# EAGLE board omni-usb_1.00a (EAGLE 6.6.0), part 1 of 3
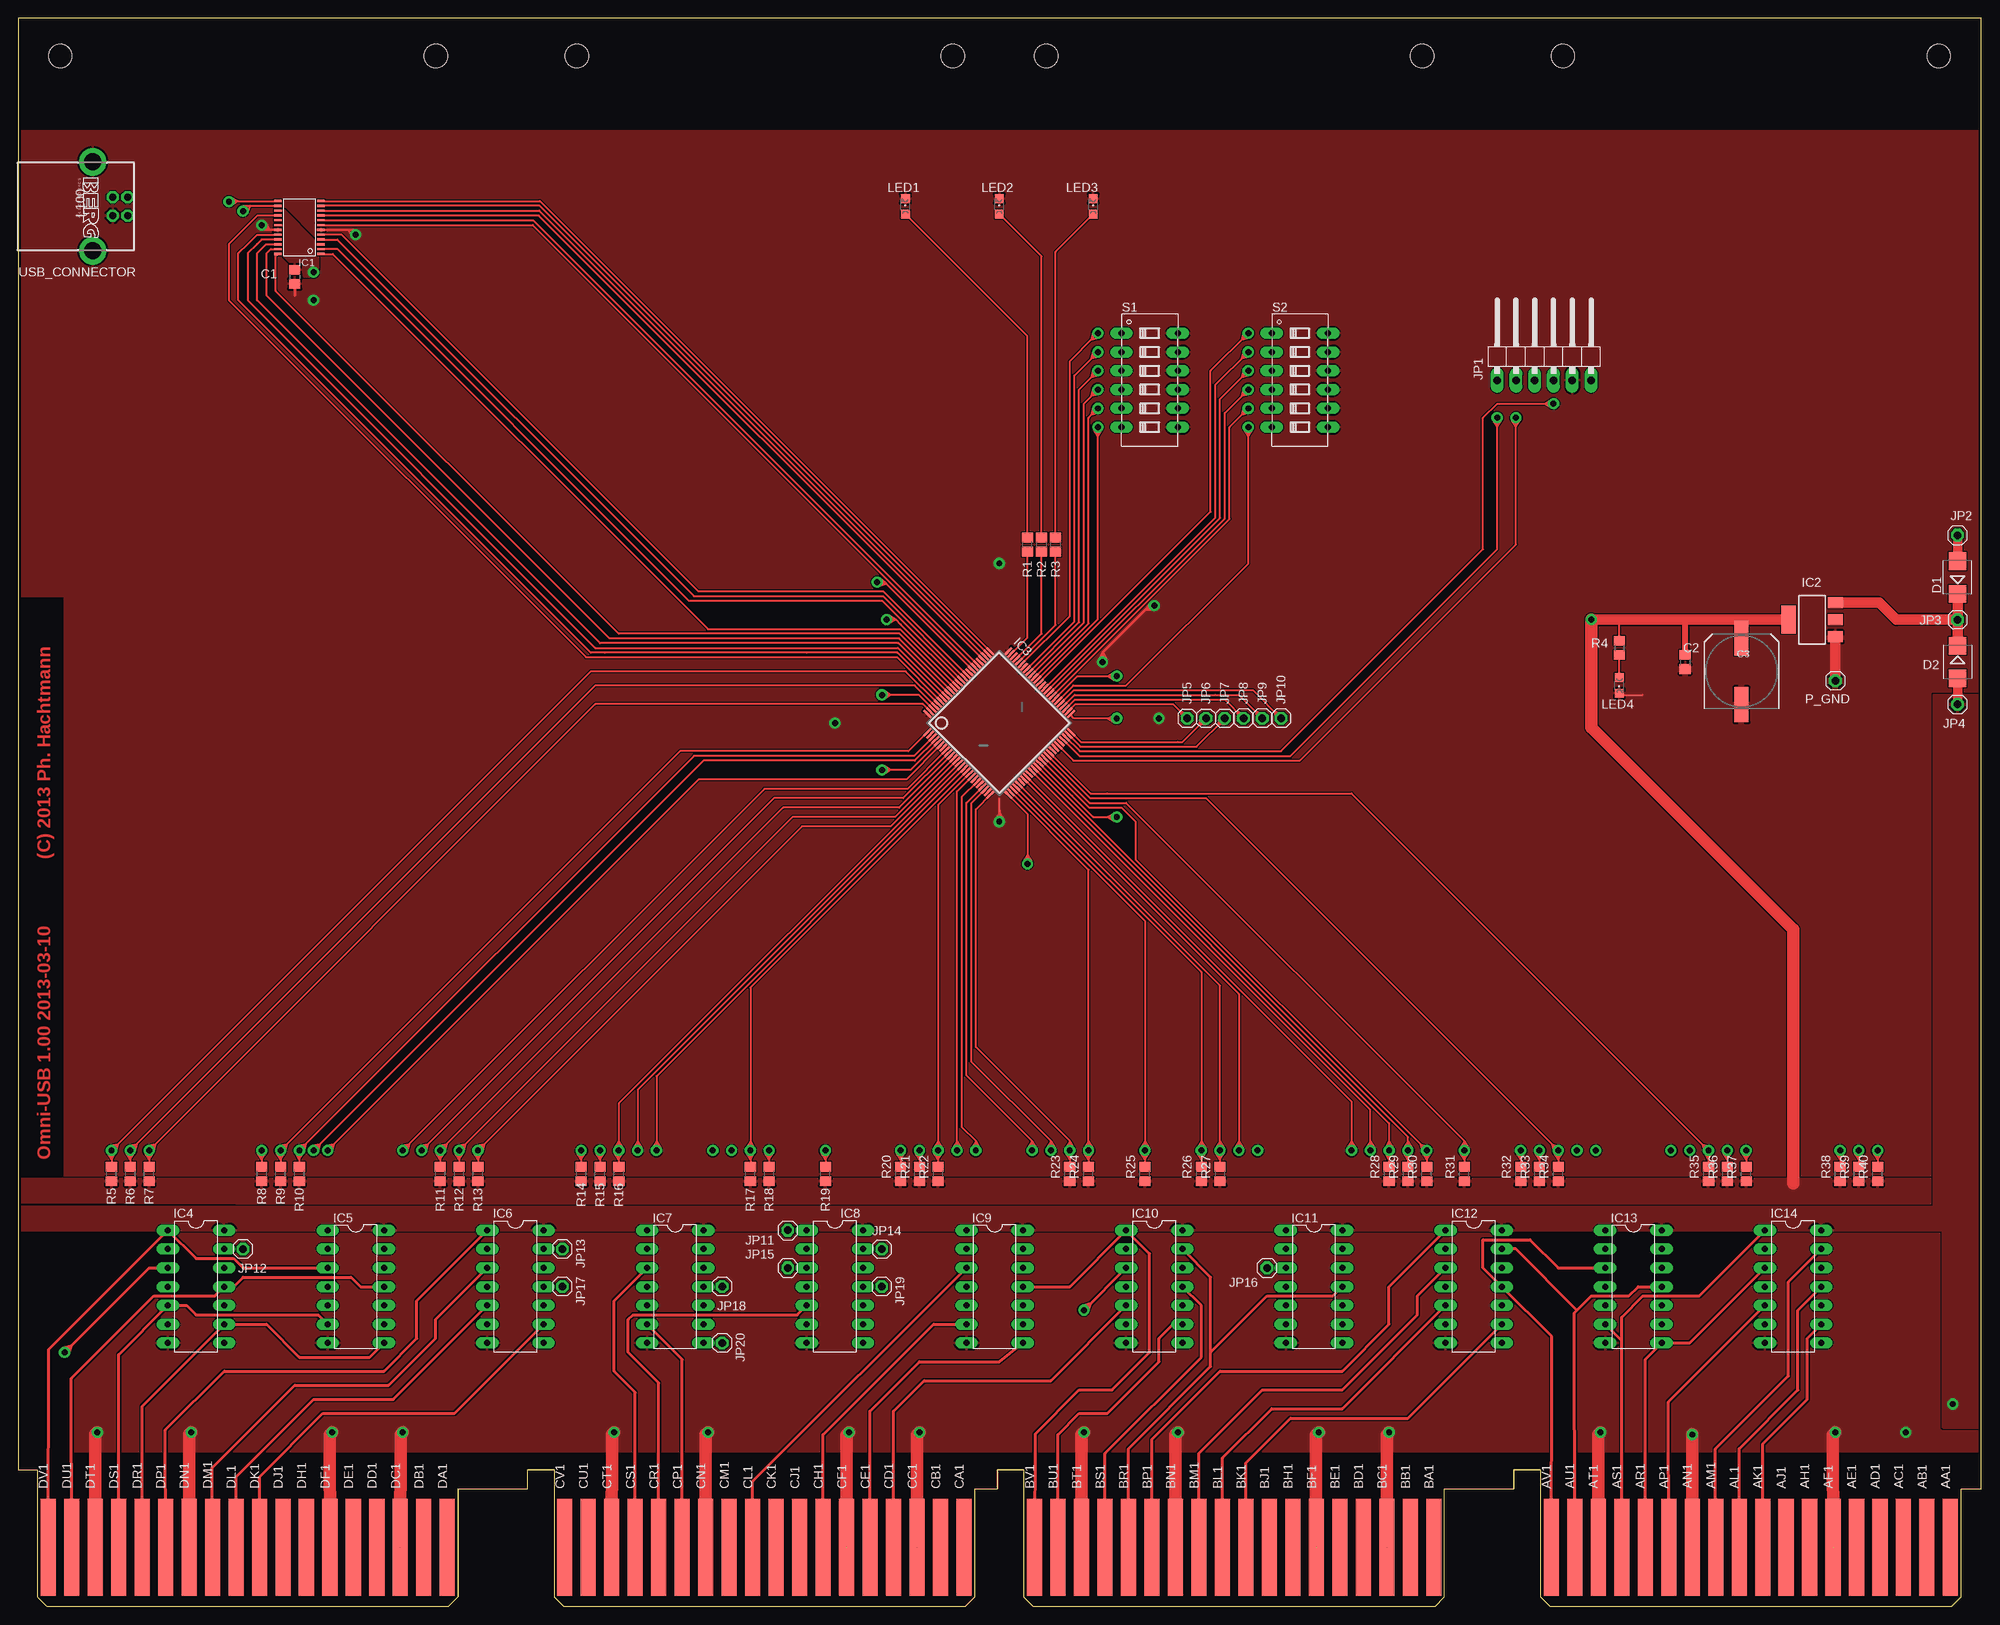
[diagram p3: board, top side]
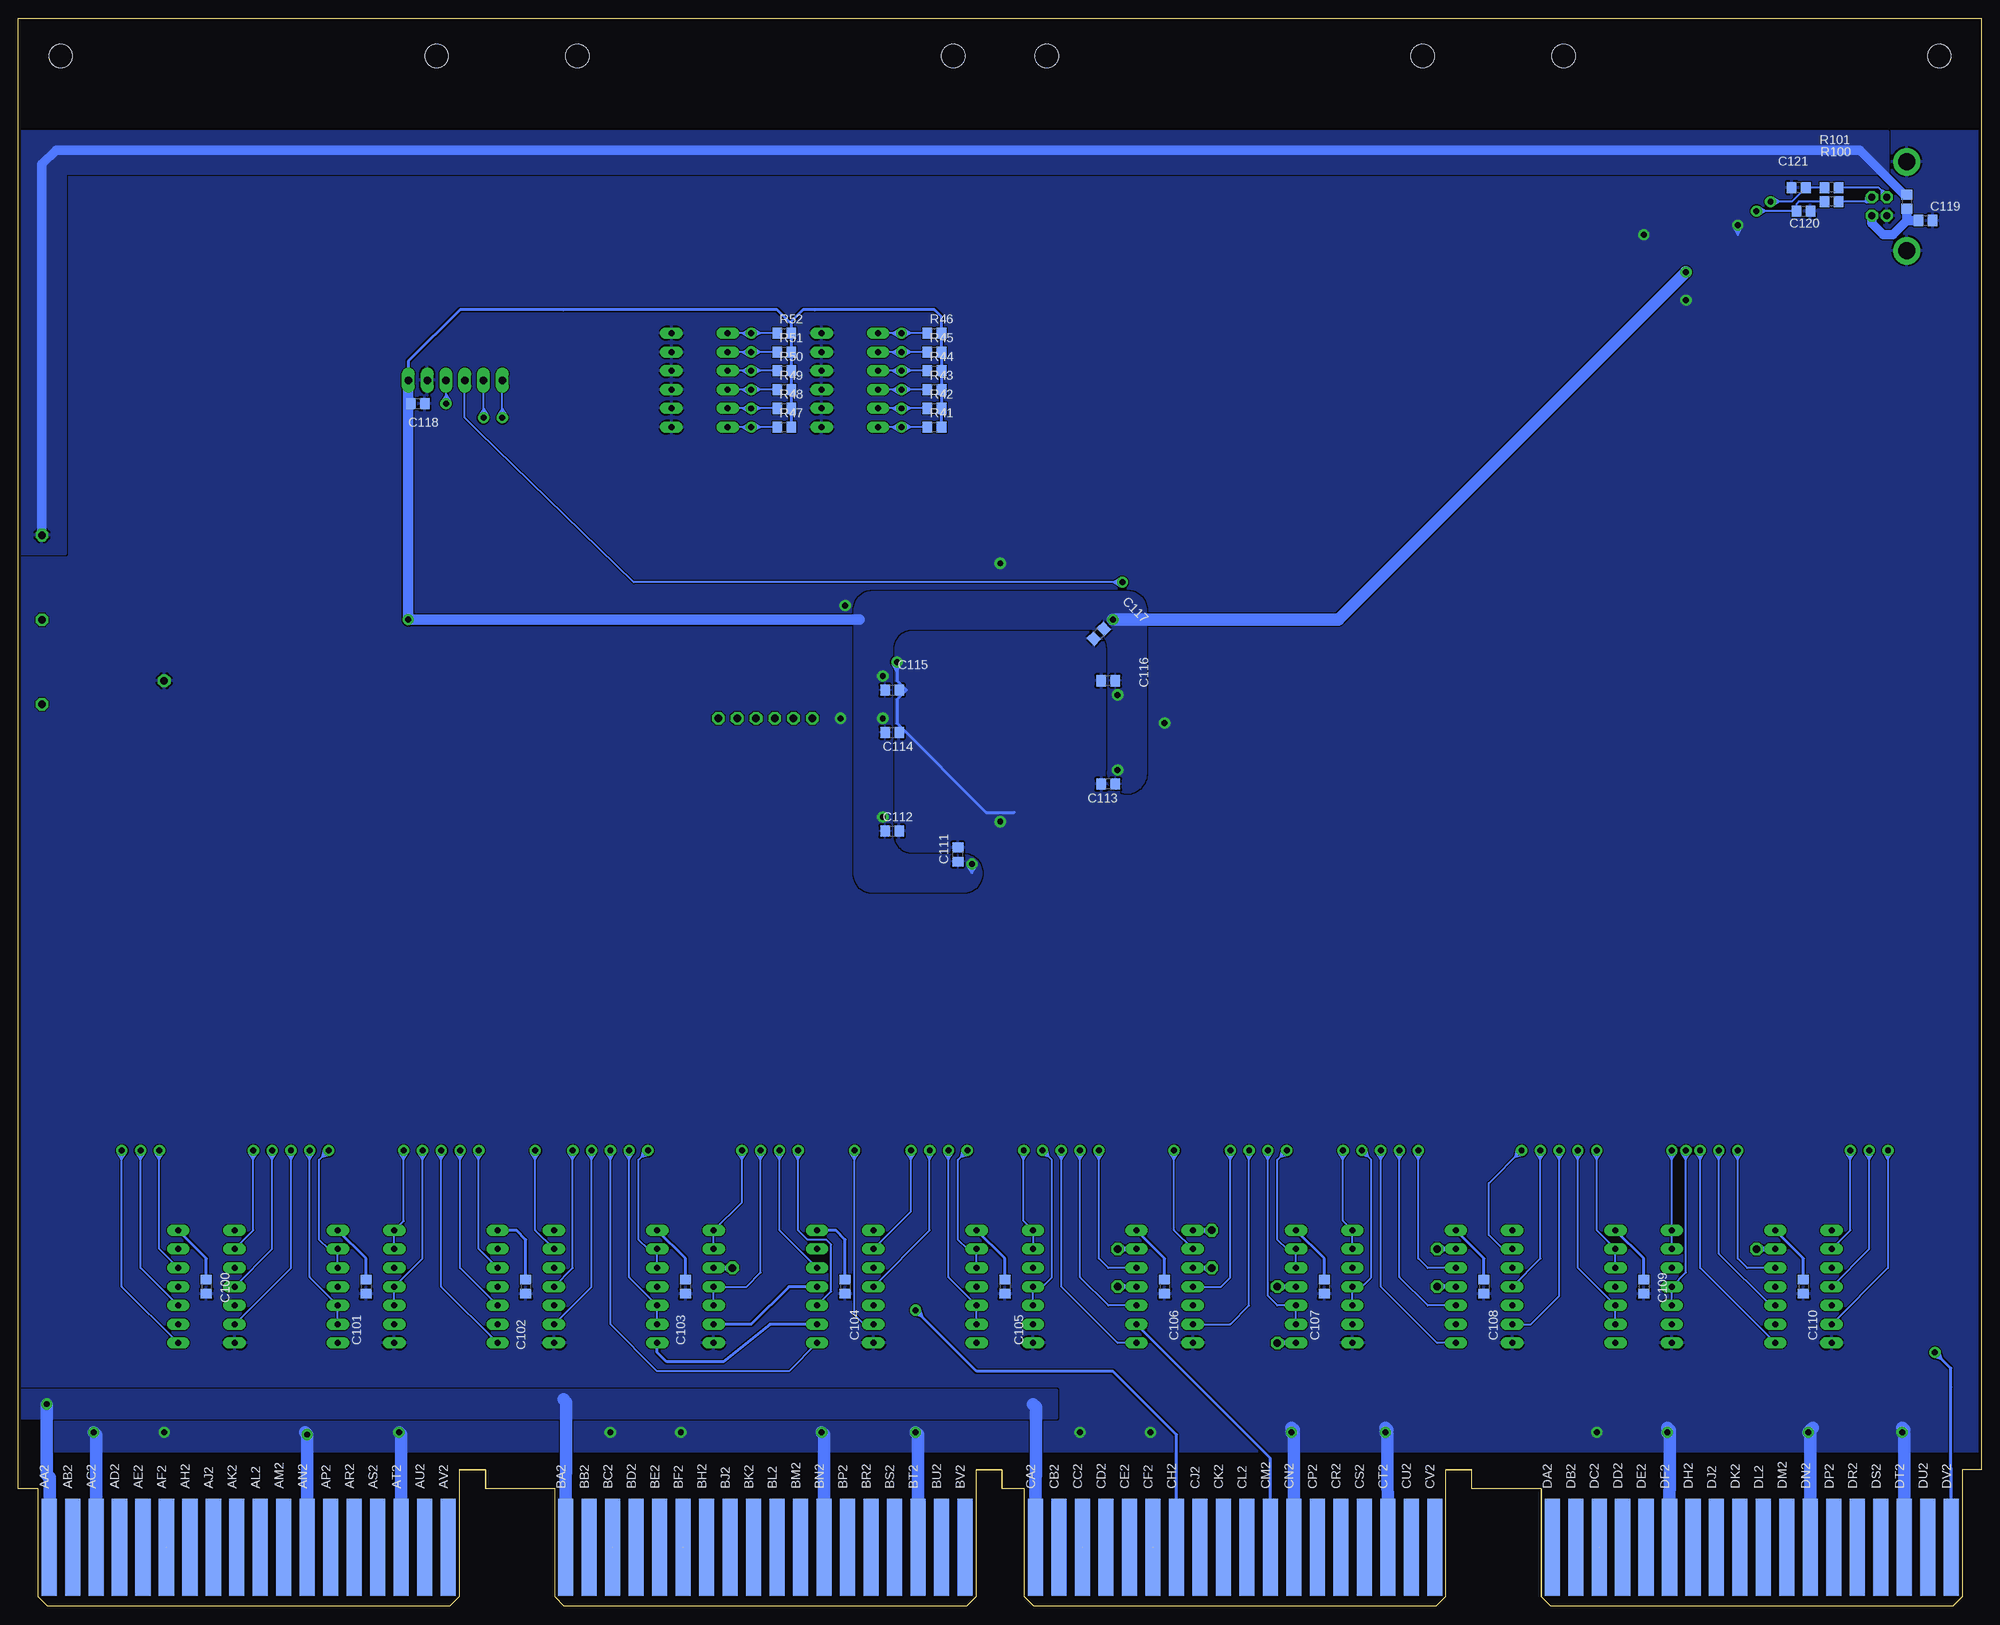
[diagram p4: board, bottom side, seen from below]

Size 265.3 x 214.63 mm. Coordinates in mm from the lower left corner, seen from the top.
Copper layers (1*16): Top 0.035mm / dielectric 1.5mm / Bottom 0.035mm
Design rules "default *": minimum track width 6mil, minimum drill 0.8mm, track to track 6mil, track to pad 6mil, pad to pad 6mil, via to via 6mil, smd to smd 6mil, copper to edge 15mil, drill to drill 8mil, minimum pad ring 14mil, minimum via ring 14mil, stop-mask expansion 4mil, vias tented up to drill 0mil, thermal gap 10mil

## Footprints (pad centres in the part's own frame; a part is rotated, then mirrored left to right if it is on the bottom)
C0805 = smd 1.3 x 1.5: 1 -0.95,0; 2 0.95,0
SANYO-OSCON_SMD_F8 = smd 4.7 x 1.9: + 4.5,0; - -4.5,0
SMB = smd 2.4 x 2.4: A 2.2,0; C -2.2,0
TSSOP24 = smd 0.305 x 0.991: 1 -3.575,-2.918; 2 -2.925,-2.918; 3 -2.275,-2.918; 4 -1.625,-2.918; 5 -0.975,-2.918; 6 -0.325,-2.918; 7 0.325,-2.918; 8 0.975,-2.918; 9 1.625,-2.918; 10 2.275,-2.918; 11 2.925,-2.918; 12 3.575,-2.918; 13 3.575,2.918; 14 2.925,2.918; 15 2.275,2.918; 16 1.625,2.918; 17 0.975,2.918; 18 0.325,2.918; 19 -0.325,2.918; 20 -0.975,2.918; 21 -1.625,2.918; 22 -2.275,2.918; 23 -2.925,2.918; 24 -3.575,2.918
SOT223 = smd 1.5 x 2: 1 -2.3,-3.15; 2 0,-3.15; 3 2.3,-3.15 | smd 3.8 x 2: 4 0,3.15
TQ100 = smd 0.3 x 1.6: 1 -6,-7.6; 2 -5.5,-7.6; 3 -5,-7.6; 4 -4.5,-7.6; 5 -4,-7.6; 6 -3.5,-7.6; 7 -3,-7.6; 8 -2.5,-7.6; 9 -2,-7.6; 10 -1.5,-7.6; 11 -1,-7.6; 12 -0.5,-7.6; 13 0,-7.6; 14 0.5,-7.6; 15 1,-7.6; 16 1.5,-7.6; 17 2,-7.6; 18 2.5,-7.6; 19 3,-7.6; 20 3.5,-7.6; 21 4,-7.6; 22 4.5,-7.6; 23 5,-7.6; 24 5.5,-7.6; 25 6,-7.6; 51 6,7.6; 52 5.5,7.6; 53 5,7.6; 54 4.5,7.6; 55 4,7.6; 56 3.5,7.6; 57 3,7.6; 58 2.5,7.6; 59 2,7.6; 60 1.5,7.6; 61 1,7.6; 62 0.5,7.6; 63 0,7.6; 64 -0.5,7.6; 65 -1,7.6; 66 -1.5,7.6; 67 -2,7.6; 68 -2.5,7.6; 69 -3,7.6; 70 -3.5,7.6; 71 -4,7.6; 72 -4.5,7.6; 73 -5,7.6; 74 -5.5,7.6; 75 -6,7.6 | smd 1.6 x 0.3: 26 7.6,-6; 27 7.6,-5.5; 28 7.6,-5; 29 7.6,-4.5; 30 7.6,-4; 31 7.6,-3.5; 32 7.6,-3; 33 7.6,-2.5; 34 7.6,-2; 35 7.6,-1.5; 36 7.6,-1; 37 7.6,-0.5; 38 7.6,0; 39 7.6,0.5; 40 7.6,1; 41 7.6,1.5; 42 7.6,2; 43 7.6,2.5; 44 7.6,3; 45 7.6,3.5; 46 7.6,4; 47 7.6,4.5; 48 7.6,5; 49 7.6,5.5; 50 7.6,6; 76 -7.6,6; 77 -7.6,5.5; 78 -7.6,5; 79 -7.6,4.5; 80 -7.6,4; 81 -7.6,3.5; 82 -7.6,3; 83 -7.6,2.5; 84 -7.6,2; 85 -7.6,1.5; 86 -7.6,1; 87 -7.6,0.5; 88 -7.6,0; 89 -7.6,-0.5; 90 -7.6,-1; 91 -7.6,-1.5; 92 -7.6,-2; 93 -7.6,-2.5; 94 -7.6,-3; 95 -7.6,-3.5; 96 -7.6,-4; 97 -7.6,-4.5; 98 -7.6,-5; 99 -7.6,-5.5; 100 -7.6,-6
DIL14 = drill 0.813 long: 1 -7.62,-3.81; 2 -5.08,-3.81; 3 -2.54,-3.81; 4 0,-3.81; 5 2.54,-3.81; 6 5.08,-3.81; 7 7.62,-3.81; 8 7.62,3.81; 9 5.08,3.81; 10 2.54,3.81; 11 0,3.81; 12 -2.54,3.81; 13 -5.08,3.81; 14 -7.62,3.81
1X06/90 = drill 1.016 long: 1 -6.35,-3.81; 2 -3.81,-3.81; 3 -1.27,-3.81; 4 1.27,-3.81; 5 3.81,-3.81; 6 6.35,-3.81
1X01 = drill 1.016 octagon: 1 0,0
R0805 = smd 1.3 x 1.5: 1 -0.95,0; 2 0.95,0
CHIPLED_0805 = smd 1.2 x 1.2: A 0,-1.05; C 0,1.05
DIP06YL = drill 0.813 long: 1 -6.35,-3.81; 2 -3.81,-3.81; 3 -1.27,-3.81; 4 1.27,-3.81; 5 3.81,-3.81; 6 6.35,-3.81; 7 6.35,3.81; 8 3.81,3.81; 9 1.27,3.81; 10 -1.27,3.81; 11 -3.81,3.81; 12 -6.35,3.81
OMNIBUS = hole 3.175: 208.915,209.55; 259.715,209.55; 189.865,209.55; 139.065,209.55; 75.616,209.55; 126.416,209.55; 56.566,209.55; 5.766,209.55
EDGE-CON8 = smd 2.032 x 13.106: AA1 261.303,7.938; AB1 258.127,7.938; AC1 254.952,7.938; AD1 251.778,7.938; AE1 248.602,7.938; AF1 245.428,7.938; AH1 242.252,7.938; AJ1 239.077,7.938; AK1 235.903,7.938; AL1 232.727,7.938; AM1 229.553,7.938; AN1 226.377,7.938; AP1 223.202,7.938; AR1 220.028,7.938; AS1 216.852,7.938; AT1 213.678,7.938; AU1 210.502,7.938; AV1 207.327,7.938; BA1 191.452,7.938; BB1 188.278,7.938; BC1 185.102,7.938; BD1 181.928,7.938; BE1 178.752,7.938; BF1 175.577,7.938; BH1 172.403,7.938; BJ1 169.227,7.938; BK1 166.053,7.938; BL1 162.877,7.938; BM1 159.702,7.938; BN1 156.528,7.938; BP1 153.352,7.938; BR1 150.178,7.938; BS1 147.002,7.938; BT1 143.827,7.938; BU1 140.653,7.938; BV1 137.477,7.938; CA1 127.953,7.938; CB1 124.778,7.938; CC1 121.603,7.938; CD1 118.427,7.938; CE1 115.252,7.938; CF1 112.078,7.938; CH1 108.903,7.938; CJ1 105.728,7.938; CK1 102.552,7.938; CL1 99.377,7.938; CM1 96.203,7.938; CN1 93.028,7.938; CP1 89.853,7.938; CR1 86.677,7.938; CS1 83.502,7.938; CT1 80.328,7.938; CU1 77.153,7.938; CV1 73.978,7.938; DA1 58.102,7.938; DB1 54.928,7.938; DC1 51.752,7.938; DD1 48.578,7.938; DE1 45.403,7.938; DF1 42.227,7.938; DH1 39.053,7.938; DJ1 35.877,7.938; DK1 32.703,7.938; DL1 29.527,7.938; DM1 26.352,7.938; DN1 23.177,7.938; DP1 20.003,7.938; DR1 16.828,7.938; DS1 13.652,7.938; DT1 10.477,7.938; DU1 7.303,7.938; DV1 4.128,7.938 | smd 2.032 x 13.106 bottom: AA2 261.303,7.938; AB2 258.127,7.938; AC2 254.952,7.938; AD2 251.778,7.938; AE2 248.602,7.938; AF2 245.428,7.938; AH2 242.252,7.938; AJ2 239.077,7.938; AK2 235.903,7.938; AL2 232.727,7.938; AM2 229.553,7.938; AN2 226.377,7.938; AP2 223.202,7.938; AR2 220.028,7.938; AS2 216.852,7.938; AT2 213.678,7.938; AU2 210.502,7.938; AV2 207.327,7.938; BA2 191.452,7.938; BB2 188.278,7.938; BC2 185.102,7.938; BD2 181.928,7.938; BE2 178.752,7.938; BF2 175.577,7.938; BH2 172.403,7.938; BJ2 169.227,7.938; BK2 166.053,7.938; BL2 162.877,7.938; BM2 159.702,7.938; BN2 156.528,7.938; BP2 153.352,7.938; BR2 150.178,7.938; BS2 147.002,7.938; BT2 143.827,7.938; BU2 140.653,7.938; BV2 137.477,7.938; CA2 127.953,7.938; CB2 124.778,7.938; CC2 121.603,7.938; CD2 118.427,7.938; CE2 115.252,7.938; CF2 112.078,7.938; CH2 108.903,7.938; CJ2 105.728,7.938; CK2 102.552,7.938; CL2 99.377,7.938; CM2 96.203,7.938; CN2 93.028,7.938; CP2 89.853,7.938; CR2 86.677,7.938; CS2 83.502,7.938; CT2 80.328,7.938; CU2 77.153,7.938; CV2 73.978,7.938; DA2 58.102,7.938; DB2 54.928,7.938; DC2 51.752,7.938; DD2 48.578,7.938; DE2 45.403,7.938; DF2 42.227,7.938; DH2 39.053,7.938; DJ2 35.877,7.938; DK2 32.703,7.938; DL2 29.527,7.938; DM2 26.352,7.938; DN2 23.177,7.938; DP2 20.003,7.938; DR2 16.828,7.938; DS2 13.652,7.938; DT2 10.477,7.938; DU2 7.303,7.938; DV2 4.128,7.938
PN61729-S = drill 0.95 octagon: 1 1.25,4.71; 2 -1.25,4.71; 3 -1.25,2.71; 4 1.25,2.71 | drill 2.3 pad 2.9: S1 -6.02,0; S2 6.02,0

## Placement (x,y rotation side)
C1  100nF  [C0805]  37.34,179.71 270 top
C2  100nF  [C0805]  225.3,127.64 270 top
C3  220µF  [SANYO-OSCON_SMD_F8]  232.92,126.36 90 top
C100  100nF  [C0805]  239.9,43.18 270 bottom
C101  100nF  [C0805]  218.31,43.18 270 bottom
C102  100nF  [C0805]  196.72,43.18 270 bottom
C103  100nF  [C0805]  175.13,43.18 270 bottom
C104  100nF  [C0805]  153.54,43.18 270 bottom
C105  100nF  [C0805]  131.95,43.18 270 bottom
C106  100nF  [C0805]  110.36,43.18 270 bottom
C107  100nF  [C0805]  88.77,43.18 270 bottom
C108  100nF  [C0805]  67.18,43.18 270 bottom
C109  100nF  [C0805]  45.59,43.18 270 bottom
C110  100nF  [C0805]  24,43.18 270 bottom
C111  100nF  [C0805]  138.3,101.6 90 bottom
C112  100nF  [C0805]  147.19,104.78 0 bottom
C113  100nF  [C0805]  117.98,111.12 180 bottom
C114  100nF  [C0805]  147.19,118.11 0 bottom
C115  100nF  [C0805]  147.19,123.83 0 bottom
C116  100nF  [C0805]  117.98,125.09 180 bottom
C117  100nF  [C0805]  119.25,131.44 225 bottom
C118  100nF  [C0805]  211.33,162.56 0 bottom
C119  10nF  [C0805]  7.49,187.32 0 bottom
C120  47pF  [C0805]  24,188.59 0 bottom
C121  47pF  [C0805]  24.64,191.77 180 bottom
D1  [SMB]  262.13,139.06 90 top
D2  [SMB]  262.13,127.64 270 top
IC1  FT240XS  [TSSOP24]  37.97,186.37 90 top
IC2  LD117AS33TR  [SOT223]  242.44,133.35 90 top
IC3  XC9572XL_TQFP100  [TQ100]  132.59,119.38 315 top
IC4  7405N  [DIL14]  24,43.18 270 top
IC5  7438N  [DIL14]  45.59,43.18 270 top
IC6  7405N  [DIL14]  67.18,43.18 270 top
IC7  7438N  [DIL14]  88.77,43.18 270 top
IC8  7405N  [DIL14]  110.36,43.18 270 top
IC9  7438N  [DIL14]  131.95,43.18 270 top
IC10  7405N  [DIL14]  153.54,43.18 270 top
IC11  7438N  [DIL14]  175.13,43.18 270 top
IC12  7405N  [DIL14]  196.72,43.18 270 top
IC13  7438N  [DIL14]  218.31,43.18 270 top
IC14  7405N  [DIL14]  239.9,43.18 270 top
JP1  [1X06/90]  206.25,169.54 0 top
JP2  [1X01]  262.13,144.78 90 top
JP3  [1X01]  262.13,133.35 0 top
JP4  [1X01]  262.13,121.92 90 top
JP5  [1X01]  157.99,120.02 0 top
JP6  [1X01]  160.53,120.02 0 top
JP7  [1X01]  163.07,120.02 0 top
JP8  [1X01]  165.61,120.02 270 top
JP9  [1X01]  168.15,120.02 270 top
JP10  [1X01]  170.69,120.02 270 top
JP11  [1X01]  104.01,50.8 90 top
JP12  [1X01]  30.35,48.26 270 top
JP13  [1X01]  73.53,48.26 270 top
JP14  [1X01]  116.71,48.26 0 top
JP15  [1X01]  104.01,45.72 90 top
JP16  [1X01]  168.78,45.72 90 top
JP17  [1X01]  73.53,43.18 270 top
JP18  [1X01]  95.12,43.18 270 top
JP19  [1X01]  116.71,43.18 270 top
JP20  [1X01]  95.12,35.56 270 top
L100  [R0805]  10.03,189.87 270 bottom
LED1  red  [CHIPLED_0805]  119.89,189.23 0 top
LED2  green  [CHIPLED_0805]  132.59,189.23 0 top
LED3  red  [CHIPLED_0805]  145.29,189.23 0 top
LED4  green  [CHIPLED_0805]  216.41,124.46 180 top
P_GND  [1X01]  245.62,125.09 0 top
R1  330  [R0805]  136.4,143.51 90 top
R2  330  [R0805]  138.3,143.51 90 top
R3  330  [R0805]  140.21,143.51 90 top
R4  330  [R0805]  216.41,129.54 270 top
R5  1k  [R0805]  12.57,58.42 90 top
R6  1k  [R0805]  15.11,58.42 90 top
R7  1k  [R0805]  17.65,58.42 90 top
R8  1k  [R0805]  32.89,58.42 90 top
R9  1k  [R0805]  35.43,58.42 90 top
R10  1k  [R0805]  37.97,58.42 90 top
R11  1k  [R0805]  57.02,58.42 90 top
R12  1k  [R0805]  59.56,58.42 90 top
R13  1k  [R0805]  62.1,58.42 90 top
R14  1k  [R0805]  76.07,58.42 90 top
R15  1k  [R0805]  78.61,58.42 90 top
R16  1k  [R0805]  81.15,58.42 90 top
R17  1k  [R0805]  98.93,58.42 90 top
R18  1k  [R0805]  101.47,58.42 90 top
R19  1k  [R0805]  109.09,58.42 90 top
R20  1k  [R0805]  119.25,58.42 90 top
R21  1k  [R0805]  121.79,58.42 90 top
R22  1k  [R0805]  124.33,58.42 90 top
R23  1k  [R0805]  142.11,58.42 90 top
R24  1k  [R0805]  144.65,58.42 90 top
R25  1k  [R0805]  152.27,58.42 90 top
R26  1k  [R0805]  159.89,58.42 90 top
R27  1k  [R0805]  162.43,58.42 90 top
R28  1k  [R0805]  185.29,58.42 90 top
R29  1k  [R0805]  187.83,58.42 90 top
R30  1k  [R0805]  190.37,58.42 90 top
R31  1k  [R0805]  195.45,58.42 90 top
R32  1k  [R0805]  203.07,58.42 90 top
R33  1k  [R0805]  205.61,58.42 90 top
R34  1k  [R0805]  208.15,58.42 90 top
R35  1k  [R0805]  228.47,58.42 90 top
R36  1k  [R0805]  231.01,58.42 90 top
R37  1k  [R0805]  233.55,58.42 90 top
R38  1k  [R0805]  246.25,58.42 90 top
R39  1k  [R0805]  248.79,58.42 90 top
R40  1k  [R0805]  251.33,58.42 90 top
R41  47k  [R0805]  141.48,159.38 0 bottom
R42  47k  [R0805]  141.48,161.93 0 bottom
R43  47k  [R0805]  141.48,164.47 0 bottom
R44  47k  [R0805]  141.48,167 0 bottom
R45  47k  [R0805]  141.48,169.54 0 bottom
R46  47k  [R0805]  141.48,172.09 0 bottom
R47  47k  [R0805]  161.8,159.38 0 bottom
R48  47k  [R0805]  161.8,161.93 0 bottom
R49  47k  [R0805]  161.8,164.47 0 bottom
R50  47k  [R0805]  161.8,167 0 bottom
R51  47k  [R0805]  161.8,169.54 0 bottom
R52  47k  [R0805]  161.8,172.09 0 bottom
R100  27  [R0805]  20.19,189.87 180 bottom
R101  27  [R0805]  20.19,191.77 180 bottom
S1  [DIP06YL]  152.91,165.74 270 top
S2  [DIP06YL]  173.23,165.74 270 top
U$1  OUTLINE-OMNIBUS  [OMNIBUS]  -0.13,0 0 top
U$2  [EDGE-CON8]  -0.13,0 0 top
USB_CONNECTOR  PN61729-S  [PN61729-S]  10.03,189.23 270 top

## Tracks (layer width: path | path; a pad name or v marks a point on that pad's centre or on a via)
!RD
  Top 0.254: IC3.77 70.45,189.3 IC1.11
!RESET
  Top 0.254: IC1.16 32.29,188 30.99,186.69 28.45,184.15 28.45,180.34 28.45,176.53 76.71,128.27 118.75,128.27 IC3.95
!RXF
  Top 0.254: IC1.21 32.86,184.75 32.26,184.15 30.99,182.88 30.99,177.8 30.99,176.53 77.98,129.54 118.89,129.54 IC3.93
!TXE
  Top 0.254: IC3.94 118.82,128.91 106.55,128.91 79.25,128.91 77.34,128.91 29.72,176.53 29.72,182.88 30.99,184.15 32.23,185.4 IC1.20
+3V3  (via drill 0.8)
  Top 0.254: R4.1 216.41,133.35 | IC3.38 142.43,109.54 | 142.43,109.54 | 142.43,109.54 145.29,106.68 v148.46,106.68 | IC3.5 120.58,113.03 v116.71,113.03 | IC3.26 136.4,107.08 v136.4,100.33 | IC3.98 121.71,123.19 v116.71,123.19 | IC1.18 | IC3.88 119.25,132.72 | 119.25,132.72 | 119.25,132.72 118.62,133.35 v117.35,133.35 | IC3.57 143.18,125.73 v148.46,125.73 | v148.46,120.02 142.7,120.02 IC3.51 | 147.26,120.02 148.13,119.48 | v148.46,120.02 148.13,119.48 | 147.26,120.02 148.13,120.55 | v148.46,120.02 148.13,120.55 | 147.26,106.68 148.13,106.14 | v148.46,106.68 148.13,106.14 | 147.26,106.68 148.13,107.22 | v148.46,106.68 148.13,107.22 | 117.91,113.03 117.04,113.56 | v116.71,113.03 117.04,113.56 | 117.91,113.03 117.04,112.5 | v116.71,113.03 117.04,112.5 | 136.4,101.53 135.86,100.66 | v136.4,100.33 135.86,100.66 | 136.4,101.53 136.93,100.66 | v136.4,100.33 136.93,100.66 | 117.91,123.19 117.04,123.72 | v116.71,123.19 117.04,123.72 | 117.91,123.19 117.04,122.66 | v116.71,123.19 117.04,122.66 | 118.55,133.35 117.68,133.88 | v117.35,133.35 117.68,133.88 | 118.55,133.35 117.68,132.81 | v117.35,133.35 117.68,132.81 | 147.26,125.73 148.13,125.19 | v148.46,125.73 148.13,125.19 | 147.26,125.73 148.13,126.27 | v148.46,125.73 148.13,126.27 | 147.26,120.02 148.13,119.48 | v148.46,120.02 148.13,119.48 | 147.26,120.02 148.13,120.55 | v148.46,120.02 148.13,120.55 | 147.26,120.02 148.13,119.48 | v148.46,120.02 148.13,119.48 | 147.26,120.02 148.13,120.55 | v148.46,120.02 148.13,120.55 | 147.26,120.02 148.13,119.48 | v148.46,120.02 148.13,119.48 | 147.26,120.02 148.13,120.55 | v148.46,120.02 148.13,120.55 | 147.26,106.68 148.13,106.14 | v148.46,106.68 148.13,106.14 | 147.26,106.68 148.13,107.22
  Top 0.254: v148.46,106.68 148.13,107.22 | 147.26,106.68 148.13,106.14 | v148.46,106.68 148.13,106.14 | 147.26,106.68 148.13,107.22 | v148.46,106.68 148.13,107.22 | 147.26,106.68 148.13,106.14 | v148.46,106.68 148.13,106.14 | 147.26,106.68 148.13,107.22 | v148.46,106.68 148.13,107.22 | 117.91,113.03 117.04,113.56 | v116.71,113.03 117.04,113.56 | 117.91,113.03 117.04,112.5 | v116.71,113.03 117.04,112.5 | 117.91,113.03 117.04,113.56 | v116.71,113.03 117.04,113.56 | 117.91,113.03 117.04,112.5 | v116.71,113.03 117.04,112.5 | 117.91,113.03 117.04,113.56 | v116.71,113.03 117.04,113.56 | 117.91,113.03 117.04,112.5 | v116.71,113.03 117.04,112.5 | 136.4,101.53 135.86,100.66 | v136.4,100.33 135.86,100.66 | 136.4,101.53 136.93,100.66 | v136.4,100.33 136.93,100.66 | 136.4,101.53 135.86,100.66 | v136.4,100.33 135.86,100.66 | 136.4,101.53 136.93,100.66 | v136.4,100.33 136.93,100.66 | 136.4,101.53 135.86,100.66 | v136.4,100.33 135.86,100.66 | 136.4,101.53 136.93,100.66 | v136.4,100.33 136.93,100.66 | 117.91,123.19 117.04,123.72 | v116.71,123.19 117.04,123.72 | 117.91,123.19 117.04,122.66 | v116.71,123.19 117.04,122.66 | 117.91,123.19 117.04,123.72 | v116.71,123.19 117.04,123.72 | 117.91,123.19 117.04,122.66 | v116.71,123.19 117.04,122.66 | 117.91,123.19 117.04,123.72 | v116.71,123.19 117.04,123.72 | 117.91,123.19 117.04,122.66 | v116.71,123.19 117.04,122.66 | 118.55,133.35 117.68,133.88 | v117.35,133.35 117.68,133.88 | 118.55,133.35 117.68,132.81 | v117.35,133.35 117.68,132.81 | 118.55,133.35 117.68,133.88 | v117.35,133.35 117.68,133.88 | 118.55,133.35 117.68,132.81 | v117.35,133.35 117.68,132.81 | 118.55,133.35 117.68,133.88 | v117.35,133.35 117.68,133.88 | 118.55,133.35 117.68,132.81
  Top 0.254: v117.35,133.35 117.68,132.81 | 147.26,125.73 148.13,125.19 | v148.46,125.73 148.13,125.19 | 147.26,125.73 148.13,126.27 | v148.46,125.73 148.13,126.27 | 147.26,125.73 148.13,125.19 | v148.46,125.73 148.13,125.19 | 147.26,125.73 148.13,126.27 | v148.46,125.73 148.13,126.27 | 147.26,125.73 148.13,125.19 | v148.46,125.73 148.13,125.19 | 147.26,125.73 148.13,126.27 | v148.46,125.73 148.13,126.27
  Top 0.813: C2.1 225.3,133.35 | C3.+ 232.92,133.35
  Top 1.422: v212.62,133.35 216.41,133.35 225.3,133.35 232.92,133.35 IC2.4
  Top 1.676: v212.62,133.35 212.6,133.32 212.6,118.75 239.9,91.44 239.9,57.15
  Bottom 0.254: v116.71,113.03 116.71,113.67 | v136.4,100.33 136.4,99.06 | v116.71,123.19 116.71,123.83 | 136.4,99.13 136.93,100 | v136.4,100.33 136.93,100 | 136.4,99.13 135.86,100 | v136.4,100.33 135.86,100 | 136.4,99.13 136.93,100 | v136.4,100.33 136.93,100 | 136.4,99.13 135.86,100 | v136.4,100.33 135.86,100 | 136.4,99.13 136.93,100 | v136.4,100.33 136.93,100 | 136.4,99.13 135.86,100 | v136.4,100.33 135.86,100 | 136.4,99.13 136.93,100 | v136.4,100.33 136.93,100 | 136.4,99.13 135.86,100 | v136.4,100.33 135.86,100
  Bottom 0.406: C118.1 212.6,163.51 JP1.6 212.6,168.28 205.61,175.26 191.64,175.26 162.75,175.26 161.16,173.67 160.85,173.67 | R47.2 R48.2 R49.2 R50.2 R51.2 R52.2 160.85,173.67 | R41.2 R42.2 R43.2 R44.2 R45.2 R46.2 140.53,174.31 141.48,175.26 157.67,175.26 159.26,175.26 160.53,173.99 160.85,173.67
  Bottom 1.422: 151.64,133.35 169.42,133.35 v212.62,133.35 212.62,165.71 JP1.6
  Bottom 1.676: v117.35,133.35 86.87,133.35 v39.88,180.34
  pour Top (rank 5): -0.13,54.61 -0.13,57.78 265.3,57.78 265.3,53.34
  pour Bottom: 137.67,96.52 149.73,96.52 arc90 152.27,99.06 152.27,134.62 arc90 149.73,137.16 115.44,137.16 arc90 112.9,134.62 112.9,113.03 arc90 115.44,109.86 arc90 117.98,113.03 117.98,129.54 arc-90 120.52,132.08 144.65,132.08 arc-90 147.19,129.54 147.19,104.14 arc-90 144.65,101.6 137.67,101.6 arc90 135.13,99.06 arc90
  pour Top: 35.43,189.23 35.43,182.88 38.61,179.71 39.24,179.71 40.51,180.97 40.51,184.15
/SIWU
  Top 0.254: IC1.10 70.39,188.65 IC3.78
C0_D  (via drill 0.8)
  Top 0.254: IC3.23 128.78,108.5 128.78,73.66 139.57,62.87 v139.57,61.59 | 139.57,62.8 139.04,61.92 | v139.57,61.59 139.04,61.92 | 139.57,62.8 140.11,61.92 | v139.57,61.59 140.11,61.92 | 139.57,62.8 139.04,61.92 | v139.57,61.59 139.04,61.92 | 139.57,62.8 140.11,61.92 | v139.57,61.59 140.11,61.92 | 139.57,62.8 139.04,61.92 | v139.57,61.59 139.04,61.92 | 139.57,62.8 140.11,61.92 | v139.57,61.59 140.11,61.92 | 139.57,62.8 139.04,61.92 | v139.57,61.59 139.04,61.92 | 139.57,62.8 140.11,61.92 | v139.57,61.59 140.11,61.92
  Bottom 0.254: IC9.9 IC9.10 139.57,44.45 v139.57,61.59 | 139.57,60.4 140.11,61.27 | v139.57,61.59 140.11,61.27 | 139.57,60.4 139.04,61.27 | v139.57,61.59 139.04,61.27 | 139.57,60.4 140.11,61.27 | v139.57,61.59 140.11,61.27 | 139.57,60.4 139.04,61.27 | v139.57,61.59 139.04,61.27 | 139.57,60.4 140.11,61.27 | v139.57,61.59 140.11,61.27 | 139.57,60.4 139.04,61.27 | v139.57,61.59 139.04,61.27 | 139.57,60.4 140.11,61.27 | v139.57,61.59 140.11,61.27 | 139.57,60.4 139.04,61.27 | v139.57,61.59 139.04,61.27
C0_L
  Top 0.406: U$2.CE1 115.11,26.34 121.79,33.02 132.59,33.02 IC9.8
C1_D  (via drill 0.8)
  Top 0.254: v126.87,61.59 126.87,110.13 IC3.18 | 126.87,62.8 126.34,61.92 | v126.87,61.59 126.34,61.92 | 126.87,62.8 127.41,61.92 | v126.87,61.59 127.41,61.92 | 126.87,62.8 126.34,61.92 | v126.87,61.59 126.34,61.92 | 126.87,62.8 127.41,61.92 | v126.87,61.59 127.41,61.92 | 126.87,62.8 126.34,61.92 | v126.87,61.59 126.34,61.92 | 126.87,62.8 127.41,61.92 | v126.87,61.59 127.41,61.92 | 126.87,62.8 126.34,61.92 | v126.87,61.59 126.34,61.92 | 126.87,62.8 127.41,61.92 | v126.87,61.59 127.41,61.92
  Bottom 0.254: IC9.5 IC9.4 126.87,43.18 125.6,44.45 125.6,60.33 v126.87,61.59 | 126.02,60.75 127.02,60.98 | v126.87,61.59 127.02,60.98 | 126.02,60.75 126.26,61.74 | v126.87,61.59 126.26,61.74 | 126.02,60.75 127.02,60.98 | v126.87,61.59 127.02,60.98 | 126.02,60.75 126.26,61.74 | v126.87,61.59 126.26,61.74 | 126.02,60.75 127.02,60.98 | v126.87,61.59 127.02,60.98 | 126.02,60.75 126.26,61.74 | v126.87,61.59 126.26,61.74 | 126.02,60.75 127.02,60.98 | v126.87,61.59 127.02,60.98 | 126.02,60.75 126.26,61.74 | v126.87,61.59 126.26,61.74
C1_L
  Top 0.406: U$2.CH1 108.76,23.16 123.7,38.1 IC9.6
CBUS5
  Top 0.254: IC3.91 119.04,130.81 79.88,130.81 33.53,177.16 33.53,182.88 34.09,183.45 IC1.23
CBUS6
  Top 0.254: IC3.92 118.97,130.18 78.61,130.18 32.26,176.53 32.26,182.88 33.47,184.1 IC1.22
D0
  Top 0.254: IC3.90 119.11,131.44 81.15,131.44 34.8,177.8 34.8,182.54 IC1.24
D1
  Top 0.254: IC1.4 43.09,184.75 91.31,136.53 116.86,136.53 IC3.86
D2
  Top 0.254: IC3.87 116.79,135.89 90.68,135.89 43.12,183.45 IC1.2
D3
  Top 0.254: IC3.79 70.33,188 IC1.9
D4
  Top 0.254: IC1.1 42.5,182.8 93.22,132.08 119.18,132.08 IC3.89
D5
  Top 0.254: IC1.7 69.51,186.7 IC3.82
D6
  Top 0.254: IC1.8 69.57,187.35 IC3.81
D7
  Top 0.254: IC3.85 116.93,137.16 91.95,137.16 43.71,185.4 IC1.5
DATA00_D  (via drill 0.8)
  Bottom 0.254: IC13.9 IC13.10 225.93,44.45 v225.93,61.59 | 225.93,60.4 226.47,61.27 | v225.93,61.59 226.47,61.27 | 225.93,60.4 225.4,61.27 | v225.93,61.59 225.4,61.27 | 225.93,60.4 226.47,61.27 | v225.93,61.59 226.47,61.27 | 225.93,60.4 225.4,61.27 | v225.93,61.59 225.4,61.27 | 225.93,60.4 226.47,61.27 | v225.93,61.59 226.47,61.27 | 225.93,60.4 225.4,61.27 | v225.93,61.59 225.4,61.27 | 225.93,60.4 226.47,61.27 | v225.93,61.59 226.47,61.27 | 225.93,60.4 225.4,61.27 | v225.93,61.59 225.4,61.27
DATA00_R  (via drill 0.8)
  Top 0.254: v231.01,61.59 R36.2 | 231.01,60.4 231.55,61.27 | v231.01,61.59 231.55,61.27 | 231.01,60.4 230.48,61.27 | v231.01,61.59 230.48,61.27 | 231.01,60.4 231.55,61.27 | v231.01,61.59 231.55,61.27 | 231.01,60.4 230.48,61.27 | v231.01,61.59 230.48,61.27 | 231.01,60.4 231.55,61.27 | v231.01,61.59 231.55,61.27 | 231.01,60.4 230.48,61.27 | v231.01,61.59 230.48,61.27 | 231.01,60.4 231.55,61.27 | v231.01,61.59 231.55,61.27 | 231.01,60.4 230.48,61.27 | v231.01,61.59 230.48,61.27
  Bottom 0.254: IC14.4 231.01,48.26 v231.01,61.59 | 231.01,60.4 231.55,61.27 | v231.01,61.59 231.55,61.27 | 231.01,60.4 230.48,61.27 | v231.01,61.59 230.48,61.27 | 231.01,60.4 231.55,61.27 | v231.01,61.59 231.55,61.27 | 231.01,60.4 230.48,61.27 | v231.01,61.59 230.48,61.27 | 231.01,60.4 231.55,61.27 | v231.01,61.59 231.55,61.27 | 231.01,60.4 230.48,61.27 | v231.01,61.59 230.48,61.27 | 231.01,60.4 231.55,61.27 | v231.01,61.59 231.55,61.27 | 231.01,60.4 230.48,61.27 | v231.01,61.59 230.48,61.27
DATA00L
  Top 0.406: U$2.AR1 219.91,33.35 IC13.8 225.93,35.56 IC14.3
DATA01_D  (via drill 0.8)
  Bottom 0.254: IC13.5 IC13.4 210.69,46.99 v210.69,61.59 | 210.69,60.4 211.23,61.27 | v210.69,61.59 211.23,61.27 | 210.69,60.4 210.16,61.27 | v210.69,61.59 210.16,61.27 | 210.69,60.4 211.23,61.27 | v210.69,61.59 211.23,61.27 | 210.69,60.4 210.16,61.27 | v210.69,61.59 210.16,61.27 | 210.69,60.4 211.23,61.27 | v210.69,61.59 211.23,61.27 | 210.69,60.4 210.16,61.27 | v210.69,61.59 210.16,61.27 | 210.69,60.4 211.23,61.27 | v210.69,61.59 211.23,61.27 | 210.69,60.4 210.16,61.27 | v210.69,61.59 210.16,61.27
DATA01_R  (via drill 0.8)
  Top 0.254: v233.55,61.59 R37.2 | 233.55,60.4 234.09,61.27 | v233.55,61.59 234.09,61.27 | 233.55,60.4 233.02,61.27 | v233.55,61.59 233.02,61.27 | 233.55,60.4 234.09,61.27 | v233.55,61.59 234.09,61.27 | 233.55,60.4 233.02,61.27 | v233.55,61.59 233.02,61.27 | 233.55,60.4 234.09,61.27 | v233.55,61.59 234.09,61.27 | 233.55,60.4 233.02,61.27 | v233.55,61.59 233.02,61.27 | 233.55,60.4 234.09,61.27 | v233.55,61.59 234.09,61.27 | 233.55,60.4 233.02,61.27 | v233.55,61.59 233.02,61.27
  Bottom 0.254: IC14.2 233.55,50.8 v233.55,61.59 | 233.55,60.4 234.09,61.27 | v233.55,61.59 234.09,61.27 | 233.55,60.4 233.02,61.27 | v233.55,61.59 233.02,61.27 | 233.55,60.4 234.09,61.27 | v233.55,61.59 234.09,61.27 | 233.55,60.4 233.02,61.27 | v233.55,61.59 233.02,61.27 | 233.55,60.4 234.09,61.27 | v233.55,61.59 234.09,61.27 | 233.55,60.4 233.02,61.27 | v233.55,61.59 233.02,61.27 | 233.55,60.4 234.09,61.27 | v233.55,61.59 234.09,61.27 | 233.55,60.4 233.02,61.27 | v233.55,61.59 233.02,61.27
DATA01L
  Top 0.406: U$2.AS1 216.74,35.87 | 216.74,35.87 IC13.6 | 216.74,35.87 216.74,39.06 219.58,41.91 227.2,41.91 IC14.1
DATA02_D  (via drill 0.8)
  Bottom 0.254: IC13.12 IC13.13 223.39,48.26 224.66,49.53 224.66,60.33 v223.39,61.59 | 224.24,60.75 224,61.74 | v223.39,61.59 224,61.74 | 224.24,60.75 223.25,60.98 | v223.39,61.59 223.25,60.98 | 224.24,60.75 224,61.74 | v223.39,61.59 224,61.74 | 224.24,60.75 223.25,60.98 | v223.39,61.59 223.25,60.98 | 224.24,60.75 224,61.74 | v223.39,61.59 224,61.74 | 224.24,60.75 223.25,60.98 | v223.39,61.59 223.25,60.98 | 224.24,60.75 224,61.74 | v223.39,61.59 224,61.74 | 224.24,60.75 223.25,60.98 | v223.39,61.59 223.25,60.98
DATA02_R  (via drill 0.8)
  Top 0.254: v203.07,61.59 R32.2 | 203.07,60.4 203.61,61.27 | v203.07,61.59 203.61,61.27 | 203.07,60.4 202.54,61.27 | v203.07,61.59 202.54,61.27 | 203.07,60.4 203.61,61.27 | v203.07,61.59 203.61,61.27 | 203.07,60.4 202.54,61.27 | v203.07,61.59 202.54,61.27 | 203.07,60.4 203.61,61.27 | v203.07,61.59 203.61,61.27 | 203.07,60.4 202.54,61.27 | v203.07,61.59 202.54,61.27 | 203.07,60.4 203.61,61.27 | v203.07,61.59 203.61,61.27 | 203.07,60.4 202.54,61.27 | v203.07,61.59 202.54,61.27
  Bottom 0.254: IC12.12 203.07,48.26 v203.07,61.59 | 203.07,60.4 203.61,61.27 | v203.07,61.59 203.61,61.27 | 203.07,60.4 202.54,61.27 | v203.07,61.59 202.54,61.27 | 203.07,60.4 203.61,61.27 | v203.07,61.59 203.61,61.27 | 203.07,60.4 202.54,61.27 | v203.07,61.59 202.54,61.27 | 203.07,60.4 203.61,61.27 | v203.07,61.59 203.61,61.27 | 203.07,60.4 202.54,61.27 | v203.07,61.59 202.54,61.27 | 203.07,60.4 203.61,61.27 | v203.07,61.59 203.61,61.27 | 203.07,60.4 202.54,61.27 | v203.07,61.59 202.54,61.27
DATA02L
  Top 0.406: 210.69,40.01 212.6,41.91 217.68,41.91 218.95,43.18 IC13.11 | 210.69,40.01 202.44,48.26 IC12.13 | U$2.AU1 210.36,39.67 210.69,40.01
DATA03_D  (via drill 0.8)
  Bottom 0.254: IC13.2 IC13.1 213.23,52.07 v213.23,61.59 | 213.23,60.4 213.77,61.27 | v213.23,61.59 213.77,61.27 | 213.23,60.4 212.7,61.27 | v213.23,61.59 212.7,61.27 | 213.23,60.4 213.77,61.27 | v213.23,61.59 213.77,61.27 | 213.23,60.4 212.7,61.27 | v213.23,61.59 212.7,61.27 | 213.23,60.4 213.77,61.27 | v213.23,61.59 213.77,61.27 | 213.23,60.4 212.7,61.27 | v213.23,61.59 212.7,61.27 | 213.23,60.4 213.77,61.27 | v213.23,61.59 213.77,61.27 | 213.23,60.4 212.7,61.27 | v213.23,61.59 212.7,61.27
DATA03_R  (via drill 0.8)
  Top 0.254: v205.61,61.59 R33.2 | 205.61,60.4 206.15,61.27 | v205.61,61.59 206.15,61.27 | 205.61,60.4 205.08,61.27 | v205.61,61.59 205.08,61.27 | 205.61,60.4 206.15,61.27 | v205.61,61.59 206.15,61.27 | 205.61,60.4 205.08,61.27 | v205.61,61.59 205.08,61.27 | 205.61,60.4 206.15,61.27 | v205.61,61.59 206.15,61.27 | 205.61,60.4 205.08,61.27 | v205.61,61.59 205.08,61.27 | 205.61,60.4 206.15,61.27 | v205.61,61.59 206.15,61.27 | 205.61,60.4 205.08,61.27 | v205.61,61.59 205.08,61.27
  Bottom 0.254: IC12.10 205.61,45.72 v205.61,61.59 | 205.61,60.4 206.15,61.27 | v205.61,61.59 206.15,61.27 | 205.61,60.4 205.08,61.27 | v205.61,61.59 205.08,61.27 | 205.61,60.4 206.15,61.27 | v205.61,61.59 206.15,61.27 | 205.61,60.4 205.08,61.27 | v205.61,61.59 205.08,61.27 | 205.61,60.4 206.15,61.27 | v205.61,61.59 206.15,61.27 | 205.61,60.4 205.08,61.27 | v205.61,61.59 205.08,61.27 | 205.61,60.4 206.15,61.27 | v205.61,61.59 206.15,61.27 | 205.61,60.4 205.08,61.27 | v205.61,61.59 205.08,61.27
DATA03L
  Top 0.406: U$2.AV1 207.28,31.11 207.28,36.44 IC12.11 197.99,45.72 197.99,49.53 204.34,49.53 208.15,45.72 IC13.3
DATA04_D  (via drill 0.8)
  Top 0.254: IC3.33 180.21,68.22 v180.21,61.59 | 180.21,62.8 179.68,61.92 | v180.21,61.59 179.68,61.92 | 180.21,62.8 180.75,61.92 | v180.21,61.59 180.75,61.92 | 180.21,62.8 179.68,61.92 | v180.21,61.59 179.68,61.92 | 180.21,62.8 180.75,61.92 | v180.21,61.59 180.75,61.92 | 180.21,62.8 179.68,61.92 | v180.21,61.59 179.68,61.92 | 180.21,62.8 180.75,61.92 | v180.21,61.59 180.75,61.92 | 180.21,62.8 179.68,61.92 | v180.21,61.59 179.68,61.92 | 180.21,62.8 180.75,61.92 | v180.21,61.59 180.75,61.92
  Bottom 0.254: IC11.12 IC11.13 180.21,48.26 181.48,49.53 181.48,60.33 v180.21,61.59 | 181.06,60.75 180.82,61.74 | v180.21,61.59 180.82,61.74 | 181.06,60.75 180.07,60.98 | v180.21,61.59 180.07,60.98 | 181.06,60.75 180.82,61.74 | v180.21,61.59 180.82,61.74 | 181.06,60.75 180.07,60.98 | v180.21,61.59 180.07,60.98 | 181.06,60.75 180.82,61.74 | v180.21,61.59 180.82,61.74 | 181.06,60.75 180.07,60.98 | v180.21,61.59 180.07,60.98 | 181.06,60.75 180.82,61.74 | v180.21,61.59 180.82,61.74 | 181.06,60.75 180.07,60.98 | v180.21,61.59 180.07,60.98
DATA04_R  (via drill 0.8)
  Top 0.254: v162.43,61.59 R27.2 | v162.43,61.59 162.43,83.88 IC3.30 | 162.43,60.4 162.97,61.27 | v162.43,61.59 162.97,61.27 | 162.43,60.4 161.9,61.27 | v162.43,61.59 161.9,61.27 | 162.43,62.8 161.9,61.92 | v162.43,61.59 161.9,61.92 | 162.43,62.8 162.97,61.92 | v162.43,61.59 162.97,61.92 | 162.43,60.4 162.97,61.27 | v162.43,61.59 162.97,61.27 | 162.43,60.4 161.9,61.27 | v162.43,61.59 161.9,61.27 | 162.43,62.8 161.9,61.92 | v162.43,61.59 161.9,61.92 | 162.43,62.8 162.97,61.92 | v162.43,61.59 162.97,61.92 | 162.43,60.4 162.97,61.27 | v162.43,61.59 162.97,61.27 | 162.43,60.4 161.9,61.27 | v162.43,61.59 161.9,61.27 | 162.43,60.4 162.97,61.27 | v162.43,61.59 162.97,61.27 | 162.43,60.4 161.9,61.27 | v162.43,61.59 161.9,61.27 | 162.43,62.8 161.9,61.92 | v162.43,61.59 161.9,61.92 | 162.43,62.8 162.97,61.92 | v162.43,61.59 162.97,61.92 | 162.43,62.8 161.9,61.92 | v162.43,61.59 161.9,61.92 | 162.43,62.8 162.97,61.92 | v162.43,61.59 162.97,61.92
  Bottom 0.254: IC10.12 162.43,50.8 v162.43,61.59 | 162.43,60.4 162.97,61.27 | v162.43,61.59 162.97,61.27 | 162.43,60.4 161.9,61.27 | v162.43,61.59 161.9,61.27 | 162.43,60.4 162.97,61.27 | v162.43,61.59 162.97,61.27 | 162.43,60.4 161.9,61.27 | v162.43,61.59 161.9,61.27 | 162.43,60.4 162.97,61.27 | v162.43,61.59 162.97,61.27 | 162.43,60.4 161.9,61.27 | v162.43,61.59 161.9,61.27 | 162.43,60.4 162.97,61.27 | v162.43,61.59 162.97,61.27 | 162.43,60.4 161.9,61.27 | v162.43,61.59 161.9,61.27
DATA04L
  Top 0.406: U$2.BR1 150.06,21.29 161.16,32.38 161.16,34.29 | 161.16,34.29 161.16,44.45 IC10.13 | 161.16,34.29 168.78,41.91 177.67,41.91 IC11.11
DATA05_D  (via drill 0.8)
  Top 0.254: IC3.32 164.97,82.75 v164.97,61.59 | 164.97,62.8 164.44,61.92 | v164.97,61.59 164.44,61.92 | 164.97,62.8 165.51,61.92 | v164.97,61.59 165.51,61.92 | 164.97,62.8 164.44,61.92 | v164.97,61.59 164.44,61.92 | 164.97,62.8 165.51,61.92 | v164.97,61.59 165.51,61.92 | 164.97,62.8 164.44,61.92 | v164.97,61.59 164.44,61.92 | 164.97,62.8 165.51,61.92 | v164.97,61.59 165.51,61.92 | 164.97,62.8 164.44,61.92 | v164.97,61.59 164.44,61.92 | 164.97,62.8 165.51,61.92 | v164.97,61.59 165.51,61.92
  Bottom 0.254: IC11.5 IC11.4 166.88,43.18 164.97,45.09 v164.97,61.59 | 164.97,60.4 165.51,61.27 | v164.97,61.59 165.51,61.27 | 164.97,60.4 164.44,61.27 | v164.97,61.59 164.44,61.27 | 164.97,60.4 165.51,61.27 | v164.97,61.59 165.51,61.27 | 164.97,60.4 164.44,61.27 | v164.97,61.59 164.44,61.27 | 164.97,60.4 165.51,61.27 | v164.97,61.59 165.51,61.27 | 164.97,60.4 164.44,61.27 | v164.97,61.59 164.44,61.27 | 164.97,60.4 165.51,61.27 | v164.97,61.59 165.51,61.27 | 164.97,60.4 164.44,61.27 | v164.97,61.59 164.44,61.27
DATA05_R  (via drill 0.8)
  Top 0.254: v159.89,61.59 R26.2 | IC3.29 159.89,85.71 v159.89,61.59 | 159.89,60.4 160.43,61.27 | v159.89,61.59 160.43,61.27 | 159.89,60.4 159.36,61.27 | v159.89,61.59 159.36,61.27 | 159.89,62.8 159.36,61.92 | v159.89,61.59 159.36,61.92 | 159.89,62.8 160.43,61.92 | v159.89,61.59 160.43,61.92 | 159.89,60.4 160.43,61.27 | v159.89,61.59 160.43,61.27 | 159.89,60.4 159.36,61.27 | v159.89,61.59 159.36,61.27 | 159.89,62.8 159.36,61.92 | v159.89,61.59 159.36,61.92 | 159.89,62.8 160.43,61.92 | v159.89,61.59 160.43,61.92 | 159.89,60.4 160.43,61.27 | v159.89,61.59 160.43,61.27 | 159.89,60.4 159.36,61.27 | v159.89,61.59 159.36,61.27 | 159.89,60.4 160.43,61.27 | v159.89,61.59 160.43,61.27 | 159.89,60.4 159.36,61.27 | v159.89,61.59 159.36,61.27 | 159.89,62.8 159.36,61.92 | v159.89,61.59 159.36,61.92 | 159.89,62.8 160.43,61.92 | v159.89,61.59 160.43,61.92 | 159.89,62.8 159.36,61.92 | v159.89,61.59 159.36,61.92 | 159.89,62.8 160.43,61.92 | v159.89,61.59 160.43,61.92
  Bottom 0.254: IC10.10 155.45,42.55 155.45,48.9 156.08,49.53 158.62,49.53 159.89,50.8 v159.89,61.59 | 159.89,60.4 160.43,61.27 | v159.89,61.59 160.43,61.27 | 159.89,60.4 159.36,61.27 | v159.89,61.59 159.36,61.27 | 159.89,60.4 160.43,61.27 | v159.89,61.59 160.43,61.27 | 159.89,60.4 159.36,61.27 | v159.89,61.59 159.36,61.27 | 159.89,60.4 160.43,61.27 | v159.89,61.59 160.43,61.27 | 159.89,60.4 159.36,61.27 | v159.89,61.59 159.36,61.27 | 159.89,60.4 160.43,61.27 | v159.89,61.59 160.43,61.27 | 159.89,60.4 159.36,61.27 | v159.89,61.59 159.36,61.27
DATA05L
  Top 0.406: U$2.BS1 146.89,20.65 159.89,33.66 159.89,40.64 IC10.11
  Bottom 0.406: IC10.11 161.16,43.18 166.24,38.1 IC11.6
DATA06_D  (via drill 0.8)
  Top 0.254: v182.75,61.59 182.75,67.09 IC3.35 | 182.75,62.8 182.22,61.92 | v182.75,61.59 182.22,61.92 | 182.75,62.8 183.29,61.92 | v182.75,61.59 183.29,61.92 | 182.75,62.8 182.22,61.92 | v182.75,61.59 182.22,61.92 | 182.75,62.8 183.29,61.92 | v182.75,61.59 183.29,61.92 | 182.75,62.8 182.22,61.92 | v182.75,61.59 182.22,61.92 | 182.75,62.8 183.29,61.92 | v182.75,61.59 183.29,61.92 | 182.75,62.8 182.22,61.92 | v182.75,61.59 182.22,61.92 | 182.75,62.8 183.29,61.92 | v182.75,61.59 183.29,61.92
  Bottom 0.254: IC11.9 IC11.10 182.75,44.45 v182.75,61.59 | 182.75,60.4 183.29,61.27 | v182.75,61.59 183.29,61.27 | 182.75,60.4 182.22,61.27 | v182.75,61.59 182.22,61.27 | 182.75,60.4 183.29,61.27 | v182.75,61.59 183.29,61.27 | 182.75,60.4 182.22,61.27 | v182.75,61.59 182.22,61.27 | 182.75,60.4 183.29,61.27 | v182.75,61.59 183.29,61.27 | 182.75,60.4 182.22,61.27 | v182.75,61.59 182.22,61.27 | 182.75,60.4 183.29,61.27 | v182.75,61.59 183.29,61.27 | 182.75,60.4 182.22,61.27 | v182.75,61.59 182.22,61.27
DATA06_R  (via drill 0.8)
  Top 0.254: v185.29,61.59 R28.2 | IC3.36 185.29,65.26 v185.29,61.59 | 185.29,60.4 185.83,61.27 | v185.29,61.59 185.83,61.27 | 185.29,60.4 184.76,61.27 | v185.29,61.59 184.76,61.27 | 185.29,62.8 184.76,61.92 | v185.29,61.59 184.76,61.92 | 185.29,62.8 185.83,61.92 | v185.29,61.59 185.83,61.92 | 185.29,60.4 185.83,61.27 | v185.29,61.59 185.83,61.27 | 185.29,60.4 184.76,61.27 | v185.29,61.59 184.76,61.27 | 185.29,62.8 184.76,61.92 | v185.29,61.59 184.76,61.92 | 185.29,62.8 185.83,61.92 | v185.29,61.59 185.83,61.92 | 185.29,60.4 185.83,61.27 | v185.29,61.59 185.83,61.27 | 185.29,60.4 184.76,61.27 | v185.29,61.59 184.76,61.27 | 185.29,60.4 185.83,61.27 | v185.29,61.59 185.83,61.27 | 185.29,60.4 184.76,61.27 | v185.29,61.59 184.76,61.27 | 185.29,62.8 184.76,61.92 | v185.29,61.59 184.76,61.92 | 185.29,62.8 185.83,61.92 | v185.29,61.59 185.83,61.92 | 185.29,62.8 184.76,61.92 | v185.29,61.59 184.76,61.92 | 185.29,62.8 185.83,61.92 | v185.29,61.59 185.83,61.92
  Bottom 0.254: IC10.8 161.16,31.75 178.94,31.75 185.29,38.1 v185.29,61.59 | 185.29,60.4 185.83,61.27 | v185.29,61.59 185.83,61.27 | 185.29,60.4 184.76,61.27 | v185.29,61.59 184.76,61.27 | 185.29,60.4 185.83,61.27 | v185.29,61.59 185.83,61.27 | 185.29,60.4 184.76,61.27 | v185.29,61.59 184.76,61.27 | 185.29,60.4 185.83,61.27 | v185.29,61.59 185.83,61.27 | 185.29,60.4 184.76,61.27 | v185.29,61.59 184.76,61.27 | 185.29,60.4 185.83,61.27 | v185.29,61.59 185.83,61.27 | 185.29,60.4 184.76,61.27 | v185.29,61.59 184.76,61.27
DATA06L
  Top 0.406: U$2.BU1 140.51,23.16 143.38,26.04 147.19,26.04 154.18,33.02 154.18,36.2 156.08,38.1 IC10.9
  Bottom 0.406: IC10.9 163.7,38.1 170.05,33.02 177.67,33.02 178.94,34.29 IC11.8
DATA07_D  (via drill 0.8)
  Top 0.254: v137.03,61.59 137.03,62.87 128.14,71.75 128.14,108.57 IC3.22 | 137.03,62.8 136.5,61.92 | v137.03,61.59 136.5,61.92 | 137.03,62.8 137.57,61.92 | v137.03,61.59 137.57,61.92 | 137.03,62.8 136.5,61.92 | v137.03,61.59 136.5,61.92 | 137.03,62.8 137.57,61.92 | v137.03,61.59 137.57,61.92 | 137.03,62.8 136.5,61.92 | v137.03,61.59 136.5,61.92 | 137.03,62.8 137.57,61.92 | v137.03,61.59 137.57,61.92 | 137.03,62.8 136.5,61.92 | v137.03,61.59 136.5,61.92 | 137.03,62.8 137.57,61.92 | v137.03,61.59 137.57,61.92
  Bottom 0.254: IC9.12 IC9.13 137.03,48.26 138.3,49.53 138.3,60.33 v137.03,61.59 | 137.88,60.75 137.64,61.74 | v137.03,61.59 137.64,61.74 | 137.88,60.75 136.89,60.98 | v137.03,61.59 136.89,60.98 | 137.88,60.75 137.64,61.74 | v137.03,61.59 137.64,61.74 | 137.88,60.75 136.89,60.98 | v137.03,61.59 136.89,60.98 | 137.88,60.75 137.64,61.74 | v137.03,61.59 137.64,61.74 | 137.88,60.75 136.89,60.98 | v137.03,61.59 136.89,60.98 | 137.88,60.75 137.64,61.74 | v137.03,61.59 137.64,61.74 | 137.88,60.75 136.89,60.98 | v137.03,61.59 136.89,60.98
DATA07_R  (via drill 0.8)
  Top 0.254: v144.65,61.59 R24.2 | v144.65,61.59 144.65,99.54 IC3.27 | 144.65,60.4 145.19,61.27 | v144.65,61.59 145.19,61.27 | 144.65,60.4 144.12,61.27 | v144.65,61.59 144.12,61.27 | 144.65,62.8 144.12,61.92 | v144.65,61.59 144.12,61.92 | 144.65,62.8 145.19,61.92 | v144.65,61.59 145.19,61.92 | 144.65,60.4 145.19,61.27 | v144.65,61.59 145.19,61.27 | 144.65,60.4 144.12,61.27 | v144.65,61.59 144.12,61.27 | 144.65,62.8 144.12,61.92 | v144.65,61.59 144.12,61.92 | 144.65,62.8 145.19,61.92 | v144.65,61.59 145.19,61.92 | 144.65,60.4 145.19,61.27 | v144.65,61.59 145.19,61.27 | 144.65,60.4 144.12,61.27 | v144.65,61.59 144.12,61.27 | 144.65,60.4 145.19,61.27 | v144.65,61.59 145.19,61.27 | 144.65,60.4 144.12,61.27 | v144.65,61.59 144.12,61.27 | 144.65,62.8 144.12,61.92 | v144.65,61.59 144.12,61.92 | 144.65,62.8 145.19,61.92 | v144.65,61.59 145.19,61.92 | 144.65,62.8 144.12,61.92 | v144.65,61.59 144.12,61.92 | 144.65,62.8 145.19,61.92 | v144.65,61.59 145.19,61.92
  Bottom 0.254: IC10.2 144.65,53.34 v144.65,61.59 | 144.65,60.4 145.19,61.27 | v144.65,61.59 145.19,61.27 | 144.65,60.4 144.12,61.27 | v144.65,61.59 144.12,61.27 | 144.65,60.4 145.19,61.27 | v144.65,61.59 145.19,61.27 | 144.65,60.4 144.12,61.27 | v144.65,61.59 144.12,61.27 | 144.65,60.4 145.19,61.27 | v144.65,61.59 145.19,61.27 | 144.65,60.4 144.12,61.27 | v144.65,61.59 144.12,61.27 | 144.65,60.4 145.19,61.27 | v144.65,61.59 145.19,61.27 | 144.65,60.4 144.12,61.27 | v144.65,61.59 144.12,61.27
DATA07L
  Top 0.406: IC9.11 142.11,43.18 IC10.1 152.91,47.62 152.91,34.29 147.83,29.21 143.38,29.21 137.43,23.25 U$2.BV1
DATA08_D  (via drill 0.8)
  Top 0.254: IC3.9 119.6,109.22 102.11,109.22 v54.48,61.59 | 55.33,62.44 54.34,62.21 | v54.48,61.59 54.34,62.21 | 55.33,62.44 55.09,61.45 | v54.48,61.59 55.09,61.45 | 55.33,62.44 54.34,62.21 | v54.48,61.59 54.34,62.21 | 55.33,62.44 55.09,61.45 | v54.48,61.59 55.09,61.45 | 55.33,62.44 54.34,62.21 | v54.48,61.59 54.34,62.21 | 55.33,62.44 55.09,61.45 | v54.48,61.59 55.09,61.45 | 55.33,62.44 54.34,62.21 | v54.48,61.59 54.34,62.21 | 55.33,62.44 55.09,61.45 | v54.48,61.59 55.09,61.45
  Bottom 0.254: IC5.9 IC5.10 54.48,45.72 v54.48,61.59 | 54.48,60.4 55.02,61.27 | v54.48,61.59 55.02,61.27 | 54.48,60.4 53.95,61.27 | v54.48,61.59 53.95,61.27 | 54.48,60.4 55.02,61.27 | v54.48,61.59 55.02,61.27 | 54.48,60.4 53.95,61.27 | v54.48,61.59 53.95,61.27 | 54.48,60.4 55.02,61.27 | v54.48,61.59 55.02,61.27 | 54.48,60.4 53.95,61.27 | v54.48,61.59 53.95,61.27 | 54.48,60.4 55.02,61.27 | v54.48,61.59 55.02,61.27 | 54.48,60.4 53.95,61.27 | v54.48,61.59 53.95,61.27
DATA08_R  (via drill 0.8)
  Top 0.254: v37.97,61.59 R10.2 | IC3.3 121.07,114.94 91.31,114.94 v37.97,61.59 | 37.97,60.4 38.51,61.27 | v37.97,61.59 38.51,61.27 | 37.97,60.4 37.44,61.27 | v37.97,61.59 37.44,61.27 | 38.82,62.44 37.83,62.21 | v37.97,61.59 37.83,62.21 | 38.82,62.44 38.58,61.45 | v37.97,61.59 38.58,61.45 | 37.97,60.4 38.51,61.27 | v37.97,61.59 38.51,61.27 | 37.97,60.4 37.44,61.27 | v37.97,61.59 37.44,61.27 | 38.82,62.44 37.83,62.21 | v37.97,61.59 37.83,62.21 | 38.82,62.44 38.58,61.45 | v37.97,61.59 38.58,61.45 | 37.97,60.4 38.51,61.27 | v37.97,61.59 38.51,61.27 | 37.97,60.4 37.44,61.27 | v37.97,61.59 37.44,61.27 | 37.97,60.4 38.51,61.27 | v37.97,61.59 38.51,61.27 | 37.97,60.4 37.44,61.27 | v37.97,61.59 37.44,61.27 | 38.82,62.44 37.83,62.21 | v37.97,61.59 37.83,62.21 | 38.82,62.44 38.58,61.45 | v37.97,61.59 38.58,61.45 | 38.82,62.44 37.83,62.21 | v37.97,61.59 37.83,62.21 | 38.82,62.44 38.58,61.45 | v37.97,61.59 38.58,61.45
  Bottom 0.254: IC4.8 37.97,45.72 v37.97,61.59 | 37.97,60.4 38.51,61.27 | v37.97,61.59 38.51,61.27 | 37.97,60.4 37.44,61.27 | v37.97,61.59 37.44,61.27 | 37.97,60.4 38.51,61.27 | v37.97,61.59 38.51,61.27 | 37.97,60.4 37.44,61.27 | v37.97,61.59 37.44,61.27 | 37.97,60.4 38.51,61.27 | v37.97,61.59 38.51,61.27 | 37.97,60.4 37.44,61.27 | v37.97,61.59 37.44,61.27 | 37.97,60.4 38.51,61.27 | v37.97,61.59 38.51,61.27 | 37.97,60.4 37.44,61.27 | v37.97,61.59 37.44,61.27
DATA08L
  Top 0.406: U$2.DR1 16.71,27 IC4.9 33.53,38.1 37.97,33.66 47.5,33.66 IC5.8
DATA09_D  (via drill 0.8)
  Top 0.254: IC3.4 124.03,117.17 121.16,114.3 92.58,114.3 v39.88,61.59 | 40.73,62.44 39.73,62.21 | v39.88,61.59 39.73,62.21 | 40.73,62.44 40.49,61.45 | v39.88,61.59 40.49,61.45 | 40.73,62.44 39.73,62.21 | v39.88,61.59 39.73,62.21 | 40.73,62.44 40.49,61.45 | v39.88,61.59 40.49,61.45 | 40.73,62.44 39.73,62.21 | v39.88,61.59 39.73,62.21 | 40.73,62.44 40.49,61.45 | v39.88,61.59 40.49,61.45 | 40.73,62.44 39.73,62.21 | v39.88,61.59 39.73,62.21 | 40.73,62.44 40.49,61.45 | v39.88,61.59 40.49,61.45
  Bottom 0.254: IC5.5 IC5.4 39.88,45.09 v39.88,61.59 | 39.88,60.4 40.41,61.27 | v39.88,61.59 40.41,61.27 | 39.88,60.4 39.34,61.27 | v39.88,61.59 39.34,61.27 | 39.88,60.4 40.41,61.27 | v39.88,61.59 40.41,61.27 | 39.88,60.4 39.34,61.27 | v39.88,61.59 39.34,61.27 | 39.88,60.4 40.41,61.27 | v39.88,61.59 40.41,61.27 | 39.88,60.4 39.34,61.27 | v39.88,61.59 39.34,61.27 | 39.88,60.4 40.41,61.27 | v39.88,61.59 40.41,61.27 | 39.88,60.4 39.34,61.27 | v39.88,61.59 39.34,61.27
DATA09_R  (via drill 0.8)
  Top 0.254: IC3.96 119.95,126.36 77.34,126.36 v12.57,61.59 | v12.57,61.59 R5.2 | 13.42,62.44 12.43,62.21 | v12.57,61.59 12.43,62.21 | 13.42,62.44 13.18,61.45 | v12.57,61.59 13.18,61.45 | 12.57,60.4 13.11,61.27 | v12.57,61.59 13.11,61.27 | 12.57,60.4 12.04,61.27 | v12.57,61.59 12.04,61.27 | 13.42,62.44 12.43,62.21 | v12.57,61.59 12.43,62.21 | 13.42,62.44 13.18,61.45 | v12.57,61.59 13.18,61.45 | 12.57,60.4 13.11,61.27 | v12.57,61.59 13.11,61.27 | 12.57,60.4 12.04,61.27 | v12.57,61.59 12.04,61.27 | 13.42,62.44 12.43,62.21 | v12.57,61.59 12.43,62.21 | 13.42,62.44 13.18,61.45 | v12.57,61.59 13.18,61.45 | 13.42,62.44 12.43,62.21 | v12.57,61.59 12.43,62.21 | 13.42,62.44 13.18,61.45 | v12.57,61.59 13.18,61.45 | 12.57,60.4 13.11,61.27 | v12.57,61.59 13.11,61.27 | 12.57,60.4 12.04,61.27 | v12.57,61.59 12.04,61.27 | 12.57,60.4 13.11,61.27 | v12.57,61.59 13.11,61.27 | 12.57,60.4 12.04,61.27 | v12.57,61.59 12.04,61.27
  Bottom 0.254: v12.57,61.59 12.57,45.72 IC4.6 | 12.57,60.4 13.11,61.27 | v12.57,61.59 13.11,61.27 | 12.57,60.4 12.04,61.27 | v12.57,61.59 12.04,61.27 | 12.57,60.4 13.11,61.27 | v12.57,61.59 13.11,61.27 | 12.57,60.4 12.04,61.27 | v12.57,61.59 12.04,61.27 | 12.57,60.4 13.11,61.27 | v12.57,61.59 13.11,61.27 | 12.57,60.4 12.04,61.27 | v12.57,61.59 12.04,61.27 | 12.57,60.4 13.11,61.27 | v12.57,61.59 13.11,61.27 | 12.57,60.4 12.04,61.27 | v12.57,61.59 12.04,61.27
DATA09L
  Top 0.406: U$2.DS1 13.54,33.98 IC4.5 22.73,40.64 24,39.37 40.51,39.37 IC5.6
DATA10_D  (via drill 0.8)
  Top 0.254: IC3.8 120.16,110.49 100.84,110.49 v51.94,61.59 | 52.79,62.44 51.8,62.21 | v51.94,61.59 51.8,62.21 | 52.79,62.44 52.55,61.45 | v51.94,61.59 52.55,61.45 | 52.79,62.44 51.8,62.21 | v51.94,61.59 51.8,62.21 | 52.79,62.44 52.55,61.45 | v51.94,61.59 52.55,61.45 | 52.79,62.44 51.8,62.21 | v51.94,61.59 51.8,62.21 | 52.79,62.44 52.55,61.45 | v51.94,61.59 52.55,61.45 | 52.79,62.44 51.8,62.21 | v51.94,61.59 51.8,62.21 | 52.79,62.44 52.55,61.45 | v51.94,61.59 52.55,61.45
  Bottom 0.254: IC5.12 IC5.13 51.94,50.8 v51.94,61.59 | 51.94,60.4 52.48,61.27 | v51.94,61.59 52.48,61.27 | 51.94,60.4 51.41,61.27 | v51.94,61.59 51.41,61.27 | 51.94,60.4 52.48,61.27 | v51.94,61.59 52.48,61.27 | 51.94,60.4 51.41,61.27 | v51.94,61.59 51.41,61.27 | 51.94,60.4 52.48,61.27 | v51.94,61.59 52.48,61.27 | 51.94,60.4 51.41,61.27 | v51.94,61.59 51.41,61.27 | 51.94,60.4 52.48,61.27 | v51.94,61.59 52.48,61.27 | 51.94,60.4 51.41,61.27 | v51.94,61.59 51.41,61.27
DATA10_R  (via drill 0.8)
  Top 0.254: v35.43,61.59 R9.2 | IC3.1 120.29,115.57 89.41,115.57 v35.43,61.59 | 35.43,60.4 35.97,61.27 | v35.43,61.59 35.97,61.27 | 35.43,60.4 34.9,61.27 | v35.43,61.59 34.9,61.27 | 36.28,62.44 35.29,62.21 | v35.43,61.59 35.29,62.21 | 36.28,62.44 36.04,61.45 | v35.43,61.59 36.04,61.45 | 35.43,60.4 35.97,61.27 | v35.43,61.59 35.97,61.27 | 35.43,60.4 34.9,61.27 | v35.43,61.59 34.9,61.27 | 36.28,62.44 35.29,62.21 | v35.43,61.59 35.29,62.21 | 36.28,62.44 36.04,61.45 | v35.43,61.59 36.04,61.45 | 35.43,60.4 35.97,61.27 | v35.43,61.59 35.97,61.27 | 35.43,60.4 34.9,61.27 | v35.43,61.59 34.9,61.27 | 35.43,60.4 35.97,61.27 | v35.43,61.59 35.97,61.27 | 35.43,60.4 34.9,61.27 | v35.43,61.59 34.9,61.27 | 36.28,62.44 35.29,62.21 | v35.43,61.59 35.29,62.21 | 36.28,62.44 36.04,61.45 | v35.43,61.59 36.04,61.45 | 36.28,62.44 35.29,62.21 | v35.43,61.59 35.29,62.21 | 36.28,62.44 36.04,61.45 | v35.43,61.59 36.04,61.45
  Bottom 0.254: IC4.10 28.45,40.64 35.43,47.62 v35.43,61.59 | 35.43,60.4 35.97,61.27 | v35.43,61.59 35.97,61.27 | 35.43,60.4 34.9,61.27 | v35.43,61.59 34.9,61.27 | 35.43,60.4 35.97,61.27 | v35.43,61.59 35.97,61.27 | 35.43,60.4 34.9,61.27 | v35.43,61.59 34.9,61.27 | 35.43,60.4 35.97,61.27 | v35.43,61.59 35.97,61.27 | 35.43,60.4 34.9,61.27 | v35.43,61.59 34.9,61.27 | 35.43,60.4 35.97,61.27 | v35.43,61.59 35.97,61.27 | 35.43,60.4 34.9,61.27 | v35.43,61.59 34.9,61.27
DATA10L
  Top 0.406: U$2.DU1 7.16,30.79 18.29,41.91 26.54,41.91 IC4.11 29.08,43.18 30.35,44.45 44.96,44.45 46.23,43.18 IC5.11
DATA11_D  (via drill 0.8)
  Top 0.254: IC3.6 120.02,111.76 91.95,111.76 v41.78,61.59 | 42.63,62.44 41.64,62.21 | v41.78,61.59 41.64,62.21 | 42.63,62.44 42.39,61.45 | v41.78,61.59 42.39,61.45 | 42.63,62.44 41.64,62.21 | v41.78,61.59 41.64,62.21 | 42.63,62.44 42.39,61.45 | v41.78,61.59 42.39,61.45 | 42.63,62.44 41.64,62.21 | v41.78,61.59 41.64,62.21 | 42.63,62.44 42.39,61.45 | v41.78,61.59 42.39,61.45 | 42.63,62.44 41.64,62.21 | v41.78,61.59 41.64,62.21 | 42.63,62.44 42.39,61.45 | v41.78,61.59 42.39,61.45
  Bottom 0.254: IC5.2 IC5.1 v41.78,61.59 | 41.78,60.4 42.32,61.27 | v41.78,61.59 42.32,61.27 | 41.78,60.4 41.25,61.27 | v41.78,61.59 41.25,61.27 | 41.78,60.4 42.32,61.27 | v41.78,61.59 42.32,61.27 | 41.78,60.4 41.25,61.27 | v41.78,61.59 41.25,61.27 | 41.78,60.4 42.32,61.27 | v41.78,61.59 42.32,61.27 | 41.78,60.4 41.25,61.27 | v41.78,61.59 41.25,61.27 | 41.78,60.4 42.32,61.27 | v41.78,61.59 42.32,61.27 | 41.78,60.4 41.25,61.27 | v41.78,61.59 41.25,61.27
DATA11_R  (via drill 0.8)
  Top 0.254: v17.65,61.59 R7.2 | IC3.99 122.27,121.92 77.98,121.92 v17.65,61.59 | 17.65,60.4 18.19,61.27 | v17.65,61.59 18.19,61.27 | 17.65,60.4 17.12,61.27 | v17.65,61.59 17.12,61.27 | 18.5,62.44 17.51,62.21 | v17.65,61.59 17.51,62.21 | 18.5,62.44 18.26,61.45 | v17.65,61.59 18.26,61.45 | 17.65,60.4 18.19,61.27 | v17.65,61.59 18.19,61.27 | 17.65,60.4 17.12,61.27 | v17.65,61.59 17.12,61.27 | 18.5,62.44 17.51,62.21 | v17.65,61.59 17.51,62.21 | 18.5,62.44 18.26,61.45 | v17.65,61.59 18.26,61.45 | 17.65,60.4 18.19,61.27 | v17.65,61.59 18.19,61.27 | 17.65,60.4 17.12,61.27 | v17.65,61.59 17.12,61.27 | 17.65,60.4 18.19,61.27 | v17.65,61.59 18.19,61.27 | 17.65,60.4 17.12,61.27 | v17.65,61.59 17.12,61.27 | 18.5,62.44 17.51,62.21 | v17.65,61.59 17.51,62.21 | 18.5,62.44 18.26,61.45 | v17.65,61.59 18.26,61.45 | 18.5,62.44 17.51,62.21 | v17.65,61.59 17.51,62.21 | 18.5,62.44 18.26,61.45 | v17.65,61.59 18.26,61.45
  Bottom 0.254: IC4.2 17.65,50.8 v17.65,61.59 | 17.65,60.4 18.19,61.27 | v17.65,61.59 18.19,61.27 | 17.65,60.4 17.12,61.27 | v17.65,61.59 17.12,61.27 | 17.65,60.4 18.19,61.27 | v17.65,61.59 18.19,61.27 | 17.65,60.4 17.12,61.27 | v17.65,61.59 17.12,61.27 | 17.65,60.4 18.19,61.27 | v17.65,61.59 18.19,61.27 | 17.65,60.4 17.12,61.27 | v17.65,61.59 17.12,61.27 | 17.65,60.4 18.19,61.27 | v17.65,61.59 18.19,61.27 | 17.65,60.4 17.12,61.27 | v17.65,61.59 17.12,61.27
DATA11L
  Top 0.406: U$2.DV1 4.08,34.68 IC4.1 24,46.99 29.08,46.99 30.35,45.72 IC5.3
GND  (via drill 0.8)  (6 unrouted)
  Top 0.254: U$2.DT2 10.03,7.36 | U$2.CT2 79.88,7.69 | U$2.CN2 92.58,7.69 | U$2.BN2 156.08,7.69 | U$2.BC2 185.29,7.68 | U$2.AT2 213.23,7.69 | LED4.C 216.41,123.19 219.58,123.19 | 132.59,107.61 v132.59,106.05 | v132.59,106.05 132.59,109.22 | IC1.6 44.95,186.05 44.96,186.06 v45.59,185.42 | U$2.CC2 121.48,7.31 121.16,6.99 | 132.59,107.25 132.05,106.37 | v132.59,106.05 132.05,106.37 | 132.59,107.25 133.12,106.37 | v132.59,106.05 133.12,106.37 | 132.59,107.25 132.05,106.37 | v132.59,106.05 132.05,106.37 | 132.59,107.25 133.12,106.37 | v132.59,106.05 133.12,106.37 | 132.59,107.25 132.05,106.37 | v132.59,106.05 132.05,106.37 | 132.59,107.25 133.12,106.37 | v132.59,106.05 133.12,106.37 | v45.59,185.42 45.03,185.14 44.57,186.05 45.59,186.05 v45.59,185.42
  Top 0.305: IC1.19 33.53,186.06 v32.89,186.69 | IC1.6 | v32.89,186.69 33.43,186.97 33.91,186.06 32.87,186.09 v32.89,186.69
  Top 0.406: C1.2 37.34,177.16 | v146.56,127.64 146.56,128.91 152.91,135.25 v153.54,135.25 | 146.56,128.84 146.07,127.89 | v146.56,127.64 146.07,127.89 | 146.56,128.84 147.05,127.89 | v146.56,127.64 147.05,127.89 | 146.56,128.84 146.07,127.89 | v146.56,127.64 146.07,127.89 | 146.56,128.84 147.05,127.89 | v146.56,127.64 147.05,127.89 | 146.56,128.84 146.07,127.89 | v146.56,127.64 146.07,127.89 | 146.56,128.84 147.05,127.89 | v146.56,127.64 147.05,127.89 | v153.54,135.25 153.5,134.7 152.44,134.79 153.12,135.61 v153.54,135.25
  Top 1.422: IC2.1 245.59,125.12 P_GND.1
  Top 1.676: U$2.AT2 213.56,23.19 v213.87,23.5 | U$2.AN2 v226.26,23.19 | U$2.BC2 184.98,23.18 v185.29,23.5 | v156.72,23.5 156.41,23.19 U$2.BN2 | U$2.CT2 80.21,23.19 v80.52,23.5 | v93.22,23.5 92.91,23.19 U$2.CN2 | U$2.DT2 10.36,23.19 v10.67,23.5 | U$2.DN2 23.06,23.19 v23.37,23.5 | v42.42,23.5 42.06,23.14 U$2.DF2 | U$2.CC2 121.48,23.18 v121.79,23.5 | U$2.CF2 111.91,23.14 v112.27,23.5 | U$2.BF2 175.41,8.31 175.41,23.14 v175.77,23.5 | v144.02,23.5 143.71,23.19 U$2.BT2 | U$2.DC2 51.63,23.18 v51.94,23.5 | U$2.AF2 245.26,23.14 v245.62,23.5